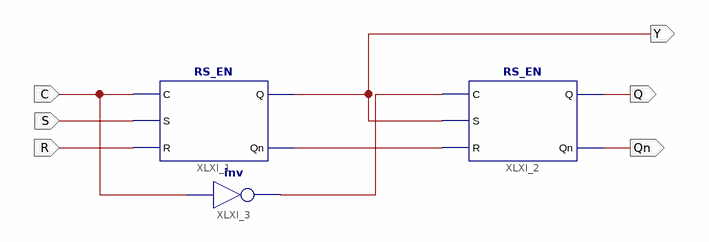
[diagram p0: schematic sheet 1]
// Xilinx ISE schematic Trigger.sch (kintex7) as structural Verilog: 3 symbols, 6 ports
module Trigger (
  input  C,
  input  S,
  input  R,
  output Y,
  output Q,
  output Qn
);

  wire XLXN_5, XLXN_8;

  RS_EN XLXI_1 (.C(C), .S(S), .R(R), .Q(Y), .Qn(XLXN_5));
  RS_EN XLXI_2 (.C(XLXN_8), .S(Y), .R(XLXN_5), .Q(Q), .Qn(Qn));
  not XLXI_3 (XLXN_8, C);
endmodule
